# Altium schematic sheet LPCB235 - POWER MANAGEMENT.SchDoc
size A3; Address1: Unit 4; DocumentNumber: 19; Revision: 2; SheetNumber: 19; SheetTotal: 37; Lockie__PCB_SUB_ASSEMBLY: Power Management; Lockie__PCB_ASSEMBLY: FCU PCB; Lockie__LDL: LPCB235; Lockie__PCB_DESCRIPTION: Flight Control Unit
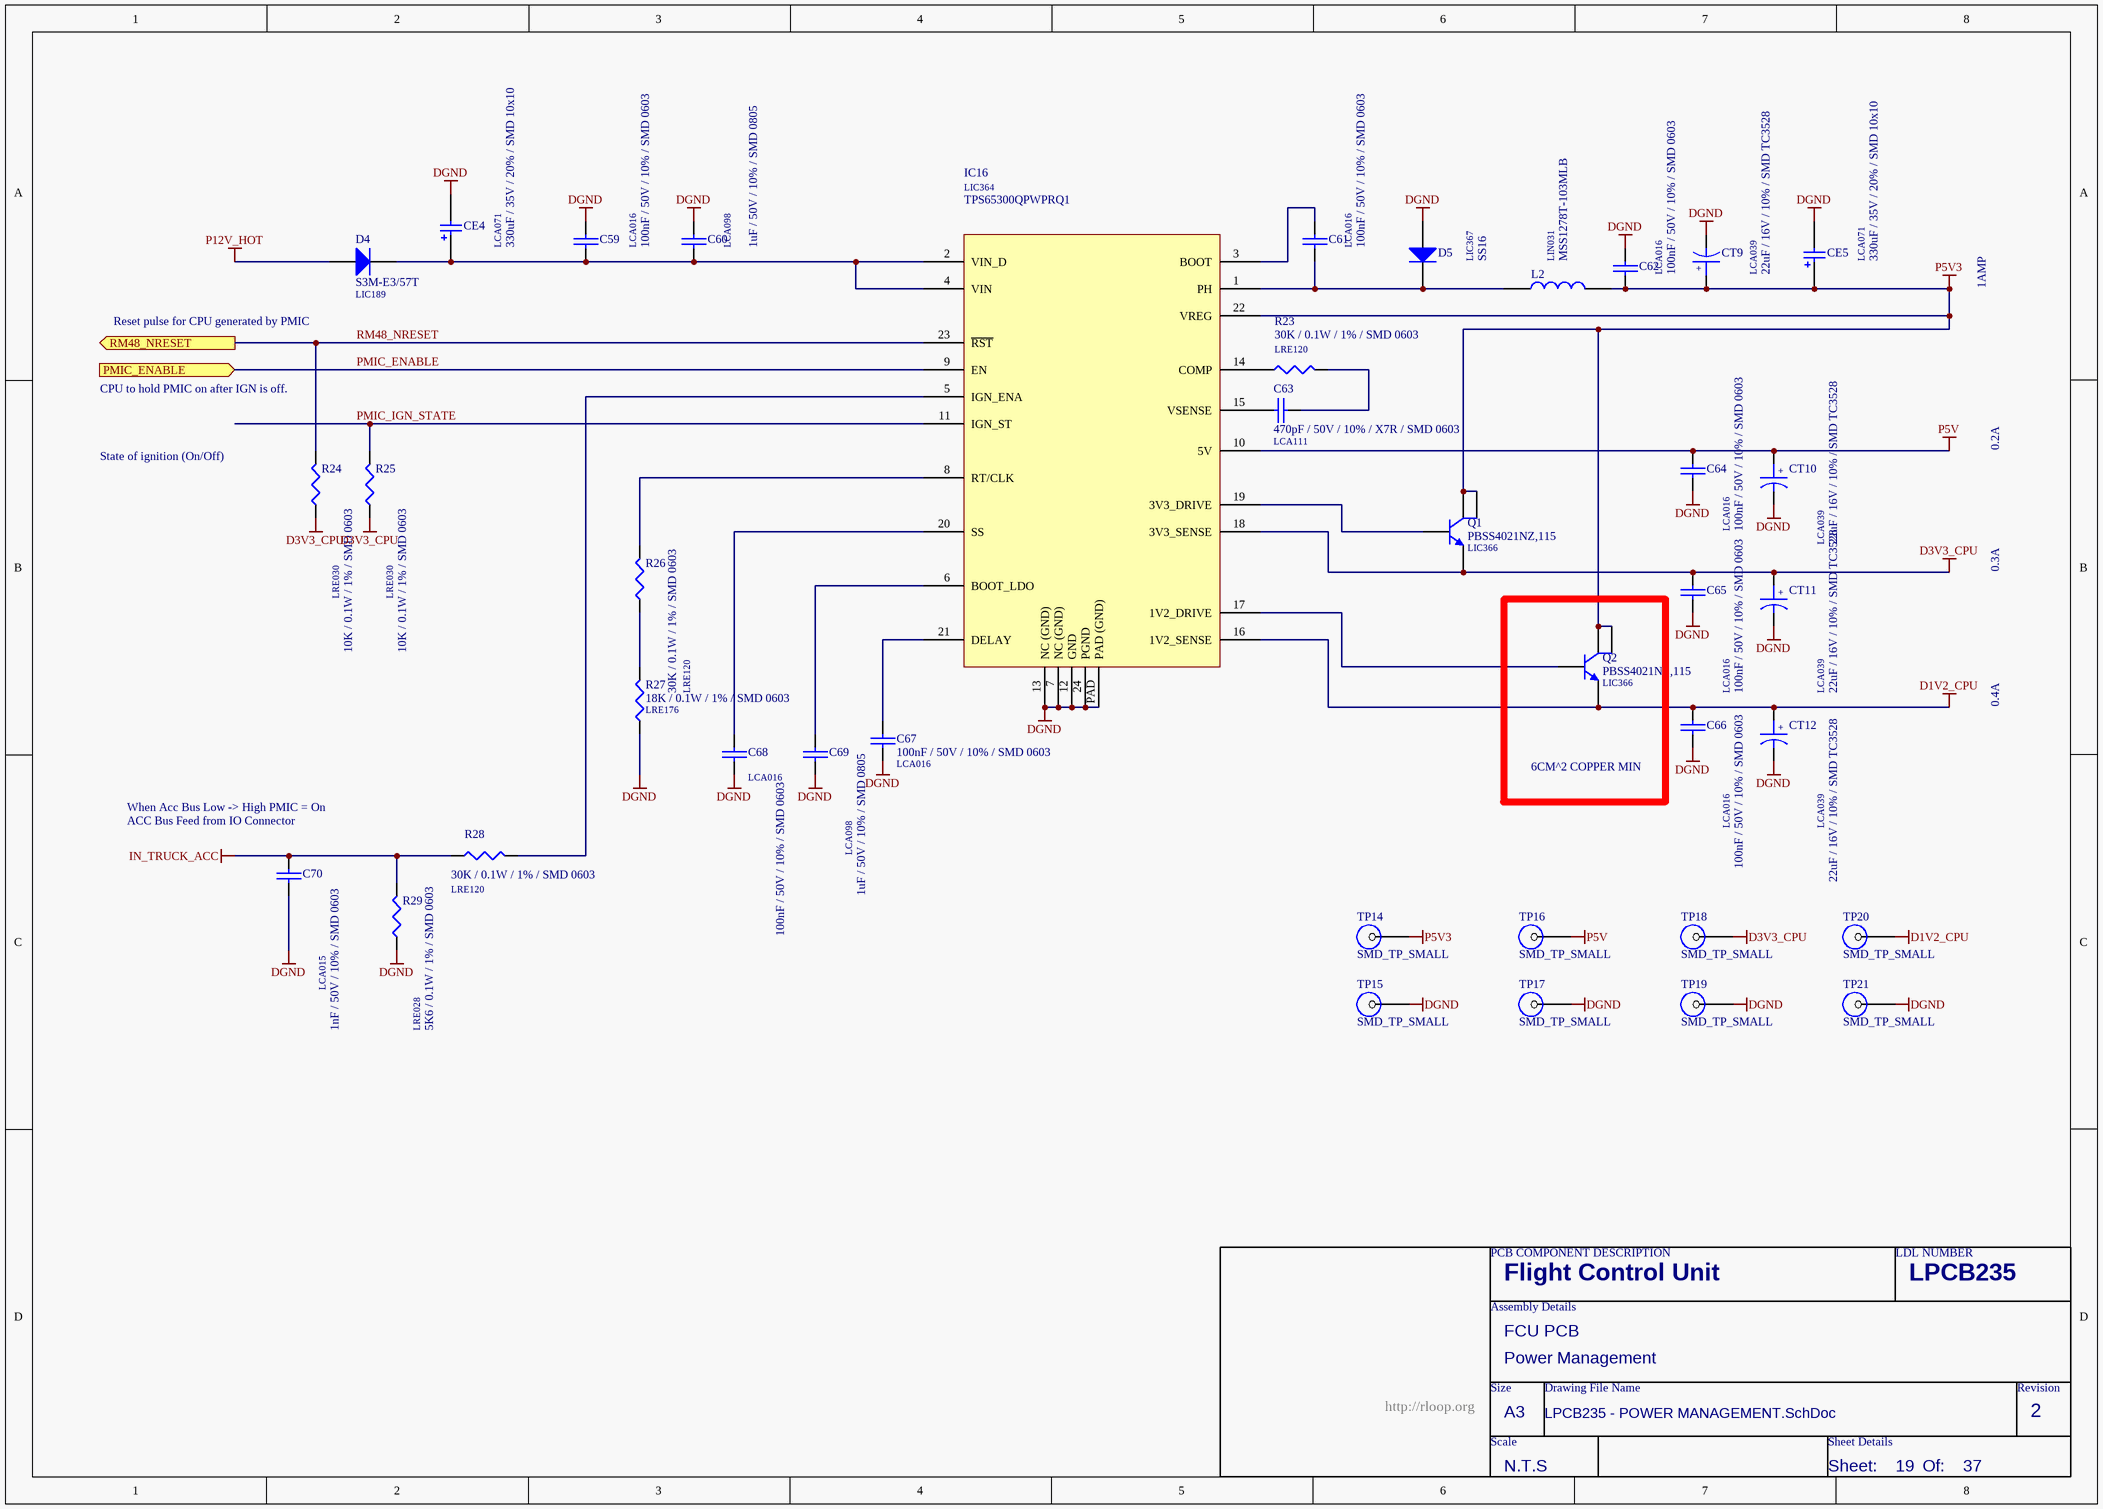
[diagram p0: LPCB235 - POWER MANAGEMENT.SchDoc]

## Parts
C59  100nF / 50V / 10% / SMD 0603  LDL_NUMBER: LCA016  [LFP011__CC1608-0603-IPC7351_B]
C60  1uF / 50V / 10% / SMD 0805  LDL_NUMBER: LCA098  [LFP010__CC2012-0805-IPC7351_B]
C61  100nF / 50V / 10% / SMD 0603  LDL_NUMBER: LCA016  [LFP011__CC1608-0603-IPC7351_B]
C62  100nF / 50V / 10% / SMD 0603  LDL_NUMBER: LCA016  [LFP011__CC1608-0603-IPC7351_B]
C63  470pF / 50V / 10% / X7R / SMD 0603  LDL_NUMBER: LCA111  [LFP011__CC1608-0603-IPC7351_B]
C64  100nF / 50V / 10% / SMD 0603  LDL_NUMBER: LCA016  [LFP011__CC1608-0603-IPC7351_B]
C65  100nF / 50V / 10% / SMD 0603  LDL_NUMBER: LCA016  [LFP011__CC1608-0603-IPC7351_B]
C66  100nF / 50V / 10% / SMD 0603  LDL_NUMBER: LCA016  [LFP011__CC1608-0603-IPC7351_B]
C67  100nF / 50V / 10% / SMD 0603  LDL_NUMBER: LCA016  [LFP011__CC1608-0603-IPC7351_B]
C68  100nF / 50V / 10% / SMD 0603  LDL_NUMBER: LCA016  [LFP011__CC1608-0603-IPC7351_B]
C69  1uF / 50V / 10% / SMD 0805  LDL_NUMBER: LCA098  [LFP010__CC2012-0805-IPC7351_B]
C70  1nF / 50V / 10% / SMD 0603  LDL_NUMBER: LCA015  [LFP011__CC1608-0603-IPC7351_B]
CE4  330uF / 35V / 20% / SMD 10x10  LDL_NUMBER: LCA071  [LFP041__NICHICON_WT_10X10]
CE5  330uF / 35V / 20% / SMD 10x10  LDL_NUMBER: LCA071  [LFP041__NICHICON_WT_10X10]
CT9  22uF / 16V / 10% / SMD TC3528  LDL_NUMBER: LCA039  [LFP018__TC3528]
CT10  22uF / 16V / 10% / SMD TC3528  LDL_NUMBER: LCA039  [LFP018__TC3528]
CT11  22uF / 16V / 10% / SMD TC3528  LDL_NUMBER: LCA039  [LFP018__TC3528]
CT12  22uF / 16V / 10% / SMD TC3528  LDL_NUMBER: LCA039  [LFP018__TC3528]
D4  S3M-E3/57T  LDL_NUMBER: LIC189  [LFP040__DO-214AB]
D5  SS16  LDL_NUMBER: LIC367  [LFP039__DO-214AC]
IC16  TPS65300QPWPRQ1  LDL_NUMBER: LIC364  [LFP036__R-PDSO-G24]
L2  MSS1278T-103MLB  LDL_NUMBER: LIN031  [LFP037__MSS1278T]
Q1  PBSS4021NZ,115  LDL_NUMBER: LIC366  [LFP038__SOT223-4M]
Q2  PBSS4021NZ,115  LDL_NUMBER: LIC366  [LFP038__SOT223-4M]
R23  30K / 0.1W / 1% / SMD 0603  LDL_NUMBER: LRE120  [LFP020__CR1608-0603-IPC7351_B]
R24  10K / 0.1W / 1% / SMD 0603  LDL_NUMBER: LRE030  [LFP020__CR1608-0603-IPC7351_B]
R25  10K / 0.1W / 1% / SMD 0603  LDL_NUMBER: LRE030  [LFP020__CR1608-0603-IPC7351_B]
R26  30K / 0.1W / 1% / SMD 0603  LDL_NUMBER: LRE120  [LFP020__CR1608-0603-IPC7351_B]
R27  18K / 0.1W / 1% / SMD 0603  LDL_NUMBER: LRE176  [LFP020__CR1608-0603-IPC7351_B]
R28  30K / 0.1W / 1% / SMD 0603  LDL_NUMBER: LRE120  [LFP020__CR1608-0603-IPC7351_B]
R29  5K6 / 0.1W / 1% / SMD 0603  LDL_NUMBER: LRE028  [LFP020__CR1608-0603-IPC7351_B]
TP14  SMD_TP_SMALL  [SMD-TP-SMALL]  (no BOM)
TP15  SMD_TP_SMALL  [SMD-TP-SMALL]  (no BOM)
TP16  SMD_TP_SMALL  [SMD-TP-SMALL]  (no BOM)
TP17  SMD_TP_SMALL  [SMD-TP-SMALL]  (no BOM)
TP18  SMD_TP_SMALL  [SMD-TP-SMALL]  (no BOM)
TP19  SMD_TP_SMALL  [SMD-TP-SMALL]  (no BOM)
TP20  SMD_TP_SMALL  [SMD-TP-SMALL]  (no BOM)
TP21  SMD_TP_SMALL  [SMD-TP-SMALL]  (no BOM)

## Blocks framed on the sheet
6CM^2 COPPER MIN: Q2

## Ports
PMIC_ENABLE (in), RM48_NRESET (out)

## Nets
D1V2_CPU: C66.1 CT12.1 IC16.16(1V2_SENSE) Q2.3(E) TP20.1
D3V3_CPU: C65.1 CT11.1 IC16.18(3V3_SENSE) Q1.3(E) R24.1 R25.1 TP18.1
DGND: C59.2 C60.2 C62.1 C64.2 C65.2 C66.2 C67.2 C68.1 C69.2 C70.2 CE4.2 CE5.2 CT9.2 CT10.2 CT11.2 CT12.2 D5.2(A) IC16.7(NC_(GND)) IC16.12(GND) IC16.13(NC_(GND)) IC16.24(PGND) IC16.PAD(PAD_(GND)) R27.1 R29.1 TP15.1 TP17.1 TP19.1 TP21.1
IN_TRUCK_ACC: C70.1 R28.1 R29.2
P5V: C64.1 CT10.1 IC16.10(5V) TP16.1
P5V3: C62.2 CE5.1 CT9.1 IC16.22(VREG) L2.2 Q1.2(C) Q1.4(C) Q2.2(C) Q2.4(C) TP14.1
P12V_HOT: D4.2(A)
PMIC_ENABLE: IC16.9(EN) ; port PMIC_ENABLE
PMIC_IGN_STATE: IC16.11(IGN_ST) R25.2
RM48_NRESET: IC16.23(~{RST}) R24.2 ; port RM48_NRESET
NetC59_1: C59.1 C60.1 CE4.1 D4.1(K) IC16.2(VIN_D) IC16.4(VIN)
NetC61_1: C61.1 D5.1(K) IC16.1(PH) L2.1
NetC61_2: C61.2 IC16.3(BOOT)
NetC63_1: C63.1 IC16.15(VSENSE)
NetC63_2: C63.2 R23.2
NetC67_1: C67.1 IC16.21(DELAY)
NetC68_2: C68.2 IC16.20(SS)
NetC69_1: C69.1 IC16.6(BOOT_LDO)
NetIC16_5: IC16.5(IGN_ENA) R28.2
NetIC16_8: IC16.8(RT/CLK) R26.2
NetIC16_14: IC16.14(COMP) R23.1
NetIC16_17: IC16.17(1V2_DRIVE) Q2.1(B)
NetIC16_19: IC16.19(3V3_DRIVE) Q1.1(B)
NetR26_1: R26.1 R27.2

## Notes on the sheet
- 1AMP
- Reset pulse for CPU generated by PMIC
- CPU to hold PMIC on after IGN is off.
- 0.2A
- State of ignition (On/Off)
- 0.3A
- 0.4A
- When Acc Bus Low -> High PMIC = On
- (near C70) ACC Bus Feed from IO Connector
- PCB COMPONENT DESCRIPTION
- LDL NUMBER
- Assembly Details
- Size
- Drawing File Name
- Revision
- http://rloop.org
- Scale
- A3
- Sheet Details
- N.T.S
- Sheet:
- Of:
- (in symbol 22uF / 16V / 10% / SMD TC3528) +

## Library data of the parts
C59 C61 C62 C64-C66 = 100nF / 50V / 10% / SMD 0603: Capacitor, Ceramic Chip, 100nF (0.1uF), 50V, 5%, SMD 0603 [LCA016]; Value: 100n; FMEDA__OPERATING__VOLTAGE_MIN: 0; FMEDA__OPERATING__VOLTAGE_MAX: 3.3; FMEDA__OPERATING__TEMP_MIN: -20; FMEDA__OPERATING__TEMP_TYP: 27; FMEDA__OPERATING__TEMP_MAX: 50; FMEDA__CHANNEL: COM; FMEDA__FUNCTION_IN_SYSTEM: *; FMEDA__OPERATING__VOLTAGE_TYP: 3.3
C60 = 1uF / 50V / 10% / SMD 0805: Capacitor, Ceramic Chip, 1uF, 50V, SMD 0805 [LCA098]; Value: 1u; FMEDA__OPERATING__VOLTAGE_MAX: 17; FMEDA__OPERATING__VOLTAGE_MIN: 0; FMEDA__OPERATING__TEMP_MAX: 50; FMEDA__OPERATING__TEMP_MIN: -20; FMEDA__OPERATING__TEMP_TYP: 27; FMEDA__OPERATING__VOLTAGE_TYP: 14; FMEDA__FUNCTION_IN_SYSTEM: POWER IN FILTER; FMEDA__CHANNEL: COM
C63 = 470pF / 50V / 10% / X7R / SMD 0603: Capacitor, Ceramic Chip, 470pF, 50V, 10% X7R, SMD 0603 [LCA111]; Value: 470p; FMEDA__OPERATING__TEMP_MAX: 50; FMEDA__OPERATING__TEMP_MIN: -20; FMEDA__OPERATING__TEMP_TYP: 27; FMEDA__OPERATING__VOLTAGE_MAX: 3.3; FMEDA__OPERATING__VOLTAGE_MIN: 0; FMEDA__FUNCTION_IN_SYSTEM: PMIC VSENSE CAP; FMEDA__CHANNEL: COM; FMEDA__OPERATING__VOLTAGE_TYP: 3.3
C67 C68 = 100nF / 50V / 10% / SMD 0603: Capacitor, Ceramic Chip, 100nF (0.1uF), 50V, 5%, SMD 0603 [LCA016]; Value: 100n; FMEDA__OPERATING__TEMP_MAX: 50; FMEDA__OPERATING__TEMP_MIN: -20; FMEDA__OPERATING__TEMP_TYP: 27; FMEDA__OPERATING__VOLTAGE_MAX: 3.3; FMEDA__OPERATING__VOLTAGE_MIN: 0; FMEDA__CHANNEL: COM; FMEDA__OPERATING__VOLTAGE_TYP: 3.3; FMEDA__FUNCTION_IN_SYSTEM: *
C69 = 1uF / 50V / 10% / SMD 0805: Capacitor, Ceramic Chip, 1uF, 50V, SMD 0805 [LCA098]; Value: 1u; FMEDA__OPERATING__VOLTAGE_MAX: 3.3; FMEDA__OPERATING__VOLTAGE_MIN: 0; FMEDA__OPERATING__TEMP_MAX: 50; FMEDA__OPERATING__TEMP_MIN: -20; FMEDA__OPERATING__TEMP_TYP: 27; FMEDA__FUNCTION_IN_SYSTEM: PMIC BOOT CAP; FMEDA__CHANNEL: COM; FMEDA__OPERATING__VOLTAGE_TYP: 3.3
C70 = 1nF / 50V / 10% / SMD 0603: Capacitor, Ceramic Chip, 1nF (1000pF), 50V, 10%, SMD 0603 [LCA015]; Value: 1n; FMEDA__FUNCTION_IN_SYSTEM: ACC BUS IN FILTER; FMEDA__OPERATING__TEMP_MAX: 50; FMEDA__OPERATING__TEMP_MIN: -20; FMEDA__OPERATING__TEMP_TYP: 27; FMEDA__OPERATING__VOLTAGE_MAX: 17; FMEDA__OPERATING__VOLTAGE_MIN: 0; FMEDA__OPERATING__VOLTAGE_TYP: 14; FMEDA__CHANNEL: COM
CE4 = 330uF / 35V / 20% / SMD 10x10: Capacitor, Aluminum Electrolytic, 330uF, 35V, 20%, SMD (10mm x 10mm); FMEDA__OPERATING__TEMP_MAX: 50; FMEDA__OPERATING__TEMP_MIN: -20; FMEDA__OPERATING__TEMP_TYP: 27; FMEDA__OPERATING__VOLTAGE_MAX: 17; FMEDA__OPERATING__VOLTAGE_MIN: 0; FMEDA__OPERATING__VOLTAGE_TYP: 14; Value: 330u; FMEDA__FUNCTION_IN_SYSTEM: POWER IN FILTER CAP; FMEDA__CHANNEL: COM
CE5 = 330uF / 35V / 20% / SMD 10x10: Capacitor, Aluminum Electrolytic, 330uF, 35V, 20%, SMD (10mm x 10mm); FMEDA__OPERATING__TEMP_MAX: 50; FMEDA__OPERATING__TEMP_MIN: -20; FMEDA__OPERATING__TEMP_TYP: 27; FMEDA__OPERATING__VOLTAGE_MAX: 5.3; FMEDA__OPERATING__VOLTAGE_MIN: 0; Value: 330u; FMEDA__FUNCTION_IN_SYSTEM: PMIC 5V3 CAP; FMEDA__CHANNEL: COM; FMEDA__OPERATING__VOLTAGE_TYP: 5.3
CT9 = 22uF / 16V / 10% / SMD TC3528: Capacitor, Tantalum, 22uF, 16V, 10%, SMD TC3528 (BCASE) [LCA039]; Value: 22u; FMEDA__OPERATING__VOLTAGE_MAX: 5.3; FMEDA__OPERATING__VOLTAGE_MIN: 0; FMEDA__OPERATING__TEMP_MAX: 50; FMEDA__OPERATING__TEMP_MIN: -20; FMEDA__OPERATING__TEMP_TYP: 27; FMEDA__FUNCTION_IN_SYSTEM: PMIC 5V3 CAP; FMEDA__CHANNEL: COM; FMEDA__OPERATING__VOLTAGE_TYP: 5.3
CT10 = 22uF / 16V / 10% / SMD TC3528: Capacitor, Tantalum, 22uF, 16V, 10%, SMD TC3528 (BCASE) [LCA039]; Value: 22u; FMEDA__OPERATING__VOLTAGE_MAX: 5; FMEDA__OPERATING__VOLTAGE_MIN: 0; FMEDA__OPERATING__TEMP_MAX: 50; FMEDA__OPERATING__TEMP_MIN: -20; FMEDA__OPERATING__TEMP_TYP: 27; FMEDA__FUNCTION_IN_SYSTEM: PMIC 5V CAP; FMEDA__CHANNEL: COM; FMEDA__OPERATING__VOLTAGE_TYP: 5
CT11 = 22uF / 16V / 10% / SMD TC3528: Capacitor, Tantalum, 22uF, 16V, 10%, SMD TC3528 (BCASE) [LCA039]; Value: 22u; FMEDA__OPERATING__VOLTAGE_MAX: 3.3; FMEDA__OPERATING__VOLTAGE_MIN: 0; FMEDA__OPERATING__TEMP_MAX: 50; FMEDA__OPERATING__TEMP_MIN: -20; FMEDA__OPERATING__TEMP_TYP: 27; FMEDA__FUNCTION_IN_SYSTEM: PMIC 3V3 CAP; FMEDA__CHANNEL: COM; FMEDA__OPERATING__VOLTAGE_TYP: 3.3
CT12 = 22uF / 16V / 10% / SMD TC3528: Capacitor, Tantalum, 22uF, 16V, 10%, SMD TC3528 (BCASE) [LCA039]; Value: 22u; FMEDA__OPERATING__VOLTAGE_MAX: 3.3; FMEDA__OPERATING__VOLTAGE_MIN: 0; FMEDA__OPERATING__TEMP_MAX: 50; FMEDA__OPERATING__TEMP_MIN: -20; FMEDA__OPERATING__TEMP_TYP: 27; FMEDA__OPERATING__VOLTAGE_TYP: 1.2; FMEDA__FUNCTION_IN_SYSTEM: PMIC 1V2 CAP; FMEDA__CHANNEL: COM
D4 = S3M-E3/57T: Diode, General Purpose Rectifier, 3A, 200V, SMD DO-214AB [LIC189]; FMEDA__OPERATING__CURRENT_MAX: 0; FMEDA__OPERATING__TEMP_MAX: 50; FMEDA__OPERATING__TEMP_MIN: -20; FMEDA__OPERATING__TEMP_TYP: 27; FMEDA__FUNCTION_IN_SYSTEM: POWER SYSTEM INPUT DIODE; FMEDA__CHANNEL: COM; FMEDA__OPERATING__CURRENT_MIN: 0; FMEDA__OPERATING__CURRENT_TYP: 0; FMEDA__OPERATING__VOLTAGE_MAX: 0; FMEDA__OPERATING__VOLTAGE_MIN: 0; FMEDA__OPERATING__VOLTAGE_TYP: 0
D5 = SS16: Diode, Schottky Rectifier, 60V, 1A, SMD DO-214AC [LIC367]; FMEDA__FUNCTION_IN_SYSTEM: PMIC PH DIODE; FMEDA__OPERATING__TEMP_MAX: 50; FMEDA__OPERATING__TEMP_MIN: -20; FMEDA__OPERATING__TEMP_TYP: 27; FMEDA__OPERATING__VOLTAGE_MAX: 0; FMEDA__CHANNEL: COM; FMEDA__OPERATING__VOLTAGE_MIN: 0; FMEDA__OPERATING__VOLTAGE_TYP: 0; FMEDA__OPERATING__CURRENT_MAX: 0; FMEDA__OPERATING__CURRENT_MIN: 0; FMEDA__OPERATING__CURRENT_TYP: 0
IC16 = TPS65300QPWPRQ1: IC, Power Management IC, SMD [LIC364]; FMEDA__FUNCTION_IN_SYSTEM: PMIC CONTROLLER; FMEDA__OPERATING__TEMP_MAX: 50; FMEDA__OPERATING__TEMP_MIN: -20; FMEDA__OPERATING__TEMP_TYP: 27; FMEDA__CHANNEL: COM
L2 = MSS1278T-103MLB: Inductor, 10uH, 20%, 5.7A, SMD [LIN031]; FMEDA__OPERATING__TEMP_MAX: 50; FMEDA__OPERATING__TEMP_MIN: -20; FMEDA__OPERATING__TEMP_TYP: 27; Value: 10u; FMEDA__CHANNEL: COM; Revision: 1; FMEDA__FUNCTION_IN_SYSTEM: *
Q1 = PBSS4021NZ,115: Transistor, NPN, 20V 8A 770mW 95MHz, SMD [LIC366]; FMEDA__FUNCTION_IN_SYSTEM: PMIC 3V3 TRANSISTOR; FMEDA__OPERATING__TEMP_MAX: 50; FMEDA__OPERATING__TEMP_MIN: -20; FMEDA__OPERATING__TEMP_TYP: 27; FMEDA__CHANNEL: COM
Q2 = PBSS4021NZ,115: Transistor, NPN, 20V 8A 770mW 95MHz, SMD [LIC366]; FMEDA__FUNCTION_IN_SYSTEM: PMIC 1V2 TRANSISTOR; FMEDA__OPERATING__TEMP_MAX: 50; FMEDA__OPERATING__TEMP_MIN: -20; FMEDA__OPERATING__TEMP_TYP: 27; FMEDA__CHANNEL: COM
R23 = 30K / 0.1W / 1% / SMD 0603: Resistor, Ceramic Chip, 30K, 0.1W, 1%, SMD 0603 [LRE120]; FMEDA__FUNCTION_IN_SYSTEM: PMIC COMP RESISTOR; FMEDA__OPERATING__POWER_MAX: 0; FMEDA__OPERATING__TEMP_MAX: 50; FMEDA__OPERATING__TEMP_MIN: -20; FMEDA__OPERATING__TEMP_TYP: 27; FMEDA__CHANNEL: COM; Value: 30K; FMEDA__OPERATING__POWER_MIN: 0; FMEDA__OPERATING__VOLTAGE_MAX: 0; FMEDA__OPERATING__VOLTAGE_MIN: 0; FMEDA__OPERATING__VOLTAGE_TYP: 0
R24 = 10K / 0.1W / 1% / SMD 0603: Resistor, Ceramic Chip, 10K, 0.1W, 1%, SMD 0603 [LRE030]; FMEDA__OPERATING__POWER_MAX: 0; FMEDA__OPERATING__VOLTAGE_MAX: 3.3; FMEDA__OPERATING__TEMP_MAX: 50; FMEDA__OPERATING__TEMP_MIN: -20; FMEDA__OPERATING__TEMP_TYP: 27; FMEDA__FUNCTION_IN_SYSTEM: RESET PULLUP; FMEDA__CHANNEL: COM; Value: 10K; FMEDA__OPERATING__POWER_MIN: 0; FMEDA__OPERATING__VOLTAGE_MIN: 0; FMEDA__OPERATING__VOLTAGE_TYP: 3.3
R25 = 10K / 0.1W / 1% / SMD 0603: Resistor, Ceramic Chip, 10K, 0.1W, 1%, SMD 0603 [LRE030]; FMEDA__OPERATING__POWER_MAX: 0; FMEDA__OPERATING__VOLTAGE_MAX: 3.3; FMEDA__OPERATING__TEMP_MAX: 50; FMEDA__OPERATING__TEMP_MIN: -20; FMEDA__OPERATING__TEMP_TYP: 27; FMEDA__FUNCTION_IN_SYSTEM: PMIC IGN PULLUP; FMEDA__CHANNEL: COM; Value: 10K; FMEDA__OPERATING__POWER_MIN: 0; FMEDA__OPERATING__VOLTAGE_MIN: 0; FMEDA__OPERATING__VOLTAGE_TYP: 3.3
R26 = 30K / 0.1W / 1% / SMD 0603: Resistor, Ceramic Chip, 30K, 0.1W, 1%, SMD 0603 [LRE120]; FMEDA__FUNCTION_IN_SYSTEM: PMIC RESISTOR; FMEDA__OPERATING__POWER_MAX: 0; FMEDA__OPERATING__TEMP_MAX: 50; FMEDA__OPERATING__TEMP_MIN: -20; FMEDA__OPERATING__TEMP_TYP: 27; FMEDA__CHANNEL: COM; Value: 30K; FMEDA__OPERATING__POWER_MIN: 0; FMEDA__OPERATING__VOLTAGE_MAX: 0; FMEDA__OPERATING__VOLTAGE_MIN: 0; FMEDA__OPERATING__VOLTAGE_TYP: 0
R27 = 18K / 0.1W / 1% / SMD 0603: Resistor, Ceramic Chip, 18K, 0.1W, 1%, SMD 0603 [LRE176]; FMEDA__OPERATING__POWER_MAX: 0; FMEDA__OPERATING__TEMP_MAX: 50; FMEDA__OPERATING__TEMP_MIN: -20; FMEDA__OPERATING__TEMP_TYP: 27; FMEDA__CHANNEL: COM; Value: 18K; FMEDA__OPERATING__POWER_MIN: 0; FMEDA__OPERATING__VOLTAGE_MAX: 0; FMEDA__OPERATING__VOLTAGE_MIN: 0; FMEDA__OPERATING__VOLTAGE_TYP: 0; FMEDA__FUNCTION_IN_SYSTEM: *
R28 = 30K / 0.1W / 1% / SMD 0603: Resistor, Ceramic Chip, 30K, 0.1W, 1%, SMD 0603 [LRE120]; FMEDA__FUNCTION_IN_SYSTEM: ACC BUS IN FILTER; FMEDA__OPERATING__POWER_MAX: 0; FMEDA__OPERATING__TEMP_MAX: 50; FMEDA__OPERATING__TEMP_MIN: -20; FMEDA__OPERATING__TEMP_TYP: 27; FMEDA__OPERATING__VOLTAGE_MAX: 17; FMEDA__OPERATING__VOLTAGE_TYP: 14; FMEDA__CHANNEL: COM; Value: 30K; FMEDA__OPERATING__POWER_MIN: 0; FMEDA__OPERATING__VOLTAGE_MIN: 0
R29 = 5K6 / 0.1W / 1% / SMD 0603: Resistor, Ceramic Chip, 5.6K, 0.1W, 1%, SMD 0603 [LRE028]; FMEDA__OPERATING__POWER_MAX: 0; FMEDA__OPERATING__TEMP_MAX: 50; FMEDA__OPERATING__TEMP_MIN: -20; FMEDA__OPERATING__TEMP_TYP: 27; FMEDA__OPERATING__VOLTAGE_MAX: 17; FMEDA__OPERATING__VOLTAGE_TYP: 14; FMEDA__FUNCTION_IN_SYSTEM: ACC BUS IN FILTER; FMEDA__CHANNEL: COM; Value: 5.6K; FMEDA__OPERATING__POWER_MIN: 0; FMEDA__OPERATING__VOLTAGE_MIN: 0
TP14-TP21 = SMD_TP_SMALL: SMD Test Point; FMEDA__CHANNEL: COM; FMEDA__OPERATING__CURRENT_MAX: 0; FMEDA__OPERATING__TEMP_MAX: 50; FMEDA__OPERATING__TEMP_MIN: -20; FMEDA__OPERATING__TEMP_TYP: 27; FMEDA__OPERATING__VOLTAGE_MAX: 16; FMEDA__OPERATING__VOLTAGE_TYP: 12; FMEDA__OPERATING__CURRENT_MIN: 0; FMEDA__OPERATING__CURRENT_TYP: 0; FMEDA__OPERATING__VOLTAGE_MIN: 0